# Altium schematic sheet OLED.SchDoc
size A4; SheetNumber: 5; SheetTotal: 7
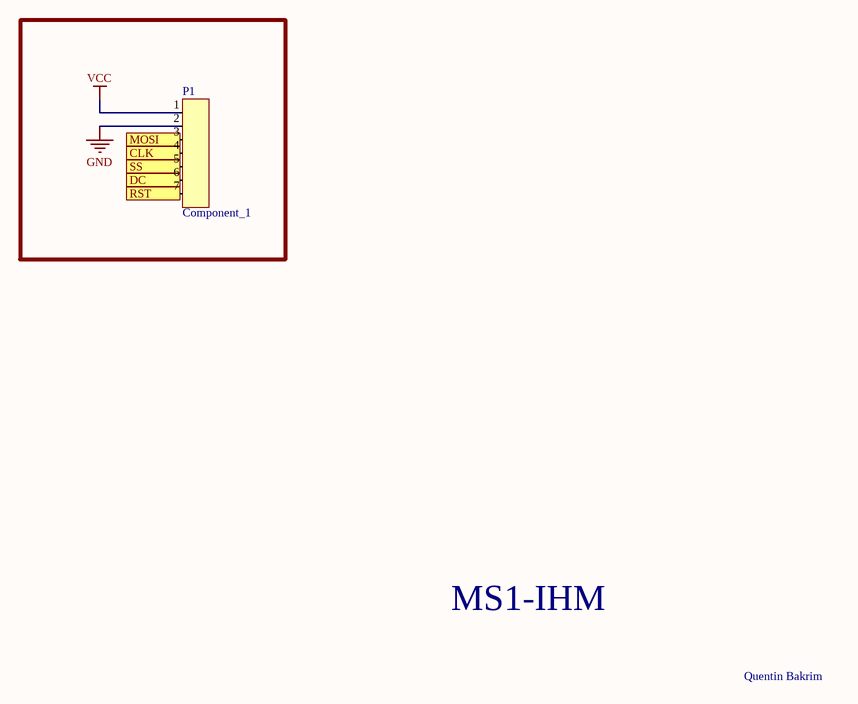
[diagram p0: OLED.SchDoc]

## Parts
P1  Component_1

## Ports
CLK, DC, MOSI, RST, SS

## Nets
GND: P1.2
VCC: P1.1
CLK: P1.4 ; port CLK
DC: P1.6 ; port DC
MOSI: P1.3 ; port MOSI
RST: P1.7 ; port RST
SS: P1.5 ; port SS

## Notes on the sheet
- MS1-IHM
- Quentin Bakrim